# Altium schematic sheet chanel.SchDoc
size A2
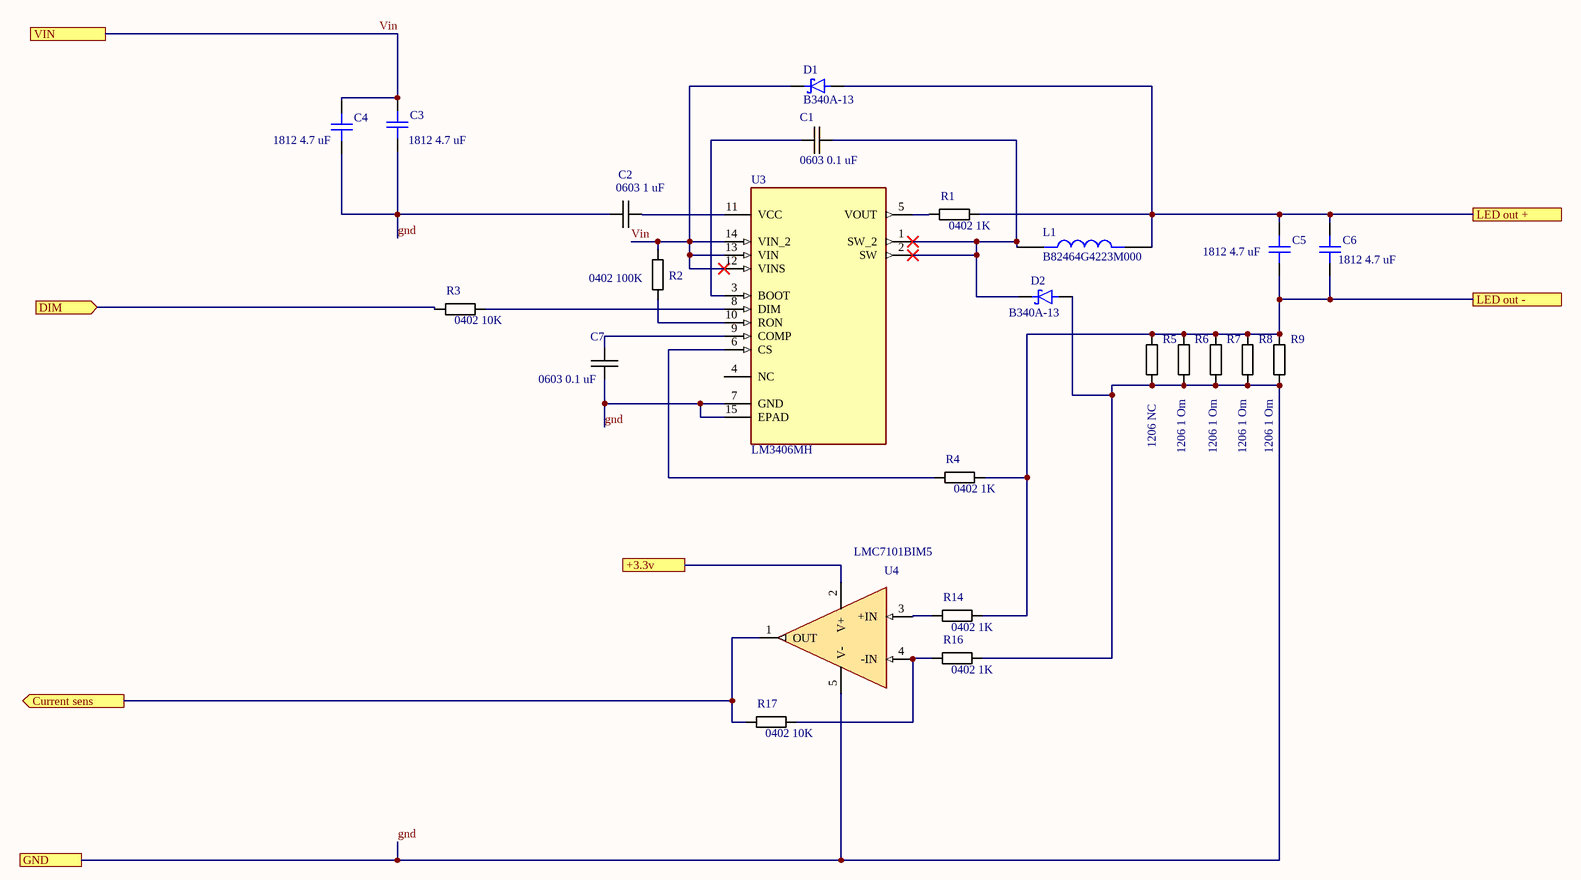
[diagram p0: chanel.SchDoc]

## Parts
C1  0603 0.1 uF  [CAPACITOR 0603]
C2  0603 1 uF  [CAPACITOR 0603]
C3  1812 4.7 uF  [CAPCHIP1812]
C4  1812 4.7 uF  [CAPCHIP1812]
C5  1812 4.7 uF  [CAPCHIP1812]
C6  1812 4.7 uF  [CAPCHIP1812]
C7  0603 0.1 uF  [CAPACITOR 0603]
D1  B340A-13  [DIOM5226X240N]
D2  B340A-13  [DIOM5226X240N]
L1  B82464G4223M000  [IND_B82464G4223M000]
R1  0402 1K  [Resistor 0402]
R2  0402 100K  [Resistor 0402]
R3  0402 10K  [Resistor 0402]
R4  0402 1K  [Resistor 0402]
R5  1206 NC  [Resistor 1206]
R6  1206 1 Om  [Resistor 1206]
R7  1206 1 Om  [Resistor 1206]
R8  1206 1 Om  [Resistor 1206]
R9  1206 1 Om  [Resistor 1206]
R14  0402 1K  [Resistor 0402]
R16  0402 1K  [Resistor 0402]
R17  0402 10K  [Resistor 0402]
U3  LM3406MH  [SOP65P640X110-15N]
U4  LMC7101BIM5  [*SOT95P280X145-5N]

## Ports
+3.3v, Current sens (out), DIM (in), GND, LED out +, LED out -, VIN

## Nets
+3.3v: U4.2(V+) ; port +3.3v
Current sens: R17.2 U4.1(OUT) ; port Current sens
DIM: R3.2 ; port DIM
gnd: C2.2 C3.1 C4.1 C7.2 D2.A R5.2 R6.2 R7.2 R8.2 R9.2 R16.1 U3.7(GND) U3.15(EPAD) U4.5(V-) ; port GND
LED out +: C5.2 C6.2 D1.A L1.2 R1.1 ; port LED out +
LED out -: C5.1 C6.1 R4.1 R5.1 R6.1 R7.1 R8.1 R9.1 R14.1 ; port LED out -
Vin: C3.2 C4.2 D1.C R2.2 U3.12(VINS) U3.13(VIN) U3.14(VIN_2) ; port VIN
NetC1_1: C1.1 D2.C L1.1 U3.1(SW_2) U3.2(SW)
NetC1_2: C1.2 U3.3(BOOT)
NetC2_1: C2.1 U3.11(VCC)
NetC7_1: C7.1 U3.9(COMP)
NetR1_2: R1.2 U3.5(VOUT)
NetR2_1: R2.1 U3.10(RON)
NetR3_1: R3.1 U3.8(DIM)
NetR4_2: R4.2 U3.6(CS)
NetR14_2: R14.2 U4.3(+IN)
NetR16_2: R16.2 R17.1 U4.4(-IN)

Not connected (* = marked no-connect by the designer): U3 4(NC)

## Library data of the parts
C1 C2 C7 = Capasitor: Ceramic Capacitor SMD; Package: 0603
  C1 C7: Value: 0603 0.1 uF
  C2: Value: 0603 1 uF
C3-C6 = Cap C: Ceramic Capacitor SMD; Class: Электронные компоненты; SubClass: Конденсаторы; TKE: {TKE}; Ordering_Information: {Ordering_Information}; Installation: {Installation}; Body: {Body}; Nominal_voltage_V: {Nominal_voltage_V}; Tolerance_Percent: {Tolerance_Percent}; Pins: {Pins}; Value: 1812 4.7 uF; Package: 1812
D1 D2 = B340A-13: Diode Schottky 40 V 3A Surface Mount SMA; MF: Diodes Inc.; Value: B340A-13; MP: B340A-13; Package: DO-214 Diodes Inc.; Availability: In Stock; Price: None; SnapEDA_Link: https://www.snapeda.com/parts/B340A-13/Diodes+Inc./view-part/?ref=snap; Check_prices: https://www.snapeda.com/parts/B340A-13/Diodes+Inc./view-part/?ref=eda; Purchase-URL: https://pricing.snapeda.com/search/part/B340A-13/?ref=eda
L1 = B82464G4223M000: MF: TDK ELECTRONICS; Check_prices: https://www.snapeda.com/parts/B82464G4223M000/TM+Electronics/view-part/?ref=eda; Package: None; Value: B82464G4223M000; MP: B82464G4223M000; SnapEDA_Link: https://www.snapeda.com/parts/B82464G4223M000/TM+Electronics/view-part/?ref=snap; Purchase-URL: https://pricing.snapeda.com/search/part/B82464G4223M000/?ref=eda
R1-R9 R14 R16 R17 = Resistor
  R1 R4 R14 R16: Value: 0402 1K; Package: 0402
  R2: Value: 0402 100K; Package: 0402
  R3 R17: Value: 0402 10K; Package: 0402
  R5: Value: 1206 NC; Package: 1206
  R6-R9: Value: 1206 1 Om; Package: 1206
U3 = LM3406MH: Constant Current Buck Regulator; Package: None; Price: None; Value: LM3406MH; MP: LM3406MH; Availability: Unavailable
U4 = LMC7101BIM5: Value: LMC7110BIM5; Check_prices: https://www.snapeda.com/parts/LMC7101BIM5/Texas%20Instruments/view-part/19255/?ref=eda; SnapEDA_Link: https://www.snapeda.com/parts/LMC7101BIM5/Texas%20Instruments/view-part/19255/?ref=snap